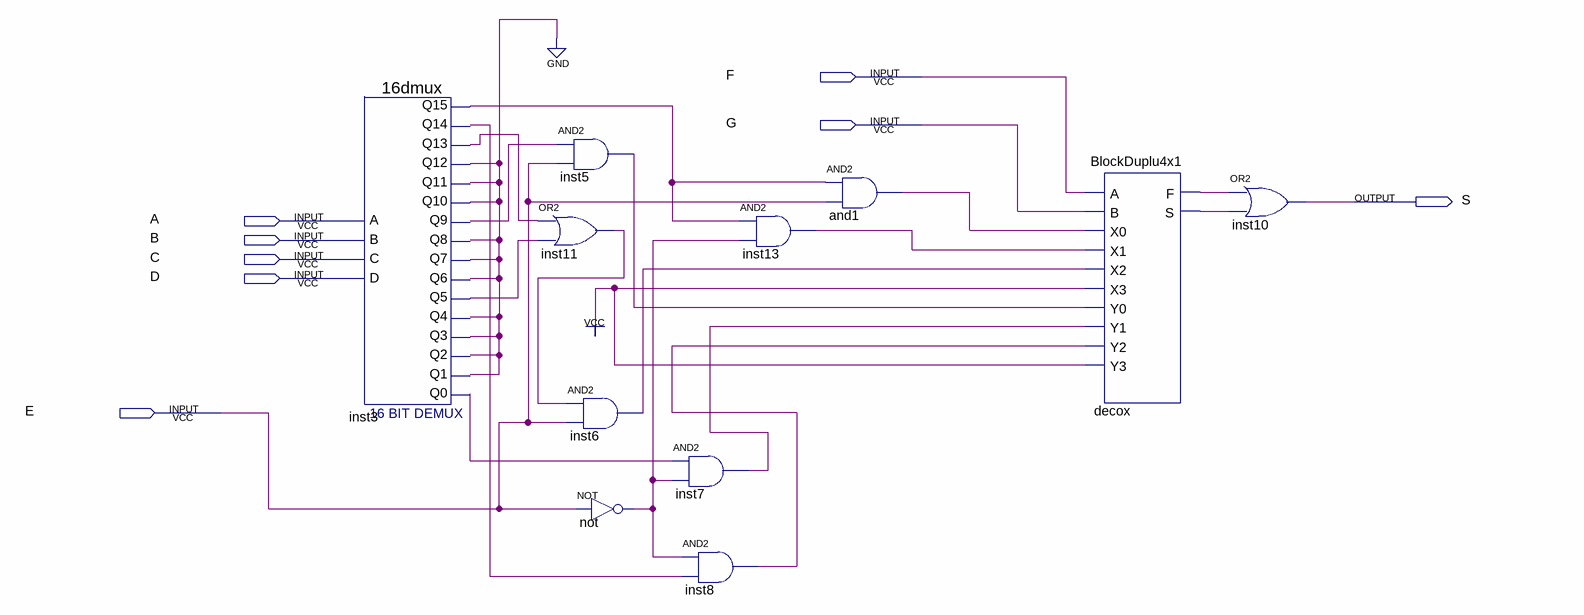
[diagram p0: schematic sheet]
// Quartus schematic multiplexdecox.bdf as structural Verilog: 11 symbols, 8 pins
module multiplexdecox (
  input  F,
  input  G,
  input  A,
  input  B,
  input  C,
  input  D,
  input  E,
  output S
);

  wire and1_out, decox_f, decox_s, inst3_q0, inst3_q5, inst3_q9, inst3_q12, inst3_q13, inst3_q14, inst3_q15,
       inst5_out, inst6_out, inst7_out, inst8_out, inst11_out, inst13_out, not_out;

  \16dmux  inst3 (
    .C(C), .B(B), .A(A), .D(D), .Q12(inst3_q12), .Q13(inst3_q13), .Q11(inst3_q12), .Q9(inst3_q9),
    .Q10(inst3_q12), .Q7(inst3_q12), .Q8(inst3_q12), .Q4(inst3_q12), .Q5(inst3_q5), .Q6(inst3_q12),
    .Q2(inst3_q12), .Q3(inst3_q12), .Q14(inst3_q14), .Q15(inst3_q15), .Q0(inst3_q0), .Q1(inst3_q12));
  and inst5 (inst5_out, inst3_q9, E);
  or inst11 (inst11_out, inst3_q13, inst3_q5);
  and inst6 (inst6_out, inst11_out, E);
  not \not  (not_out, E);
  and inst7 (inst7_out, inst3_q0, not_out);
  and inst8 (inst8_out, not_out, inst3_q14);
  and inst13 (inst13_out, inst3_q15, not_out);
  and and1 (and1_out, inst3_q15, E);
  BlockDuplu4x1 decox (
    .A(F), .B(G), .X0(and1_out), .X1(inst13_out), .X2(inst6_out), .X3(1'b1), .Y0(inst5_out), .Y1(inst7_out),
    .Y2(inst8_out), .Y3(1'b1), .F(decox_f), .S(decox_s));
  or inst10 (S, decox_f, decox_s);
  // also tied to GND on the sheet: inst3_q12
endmodule
